# Altium project BoardDisplay.PrjPcb
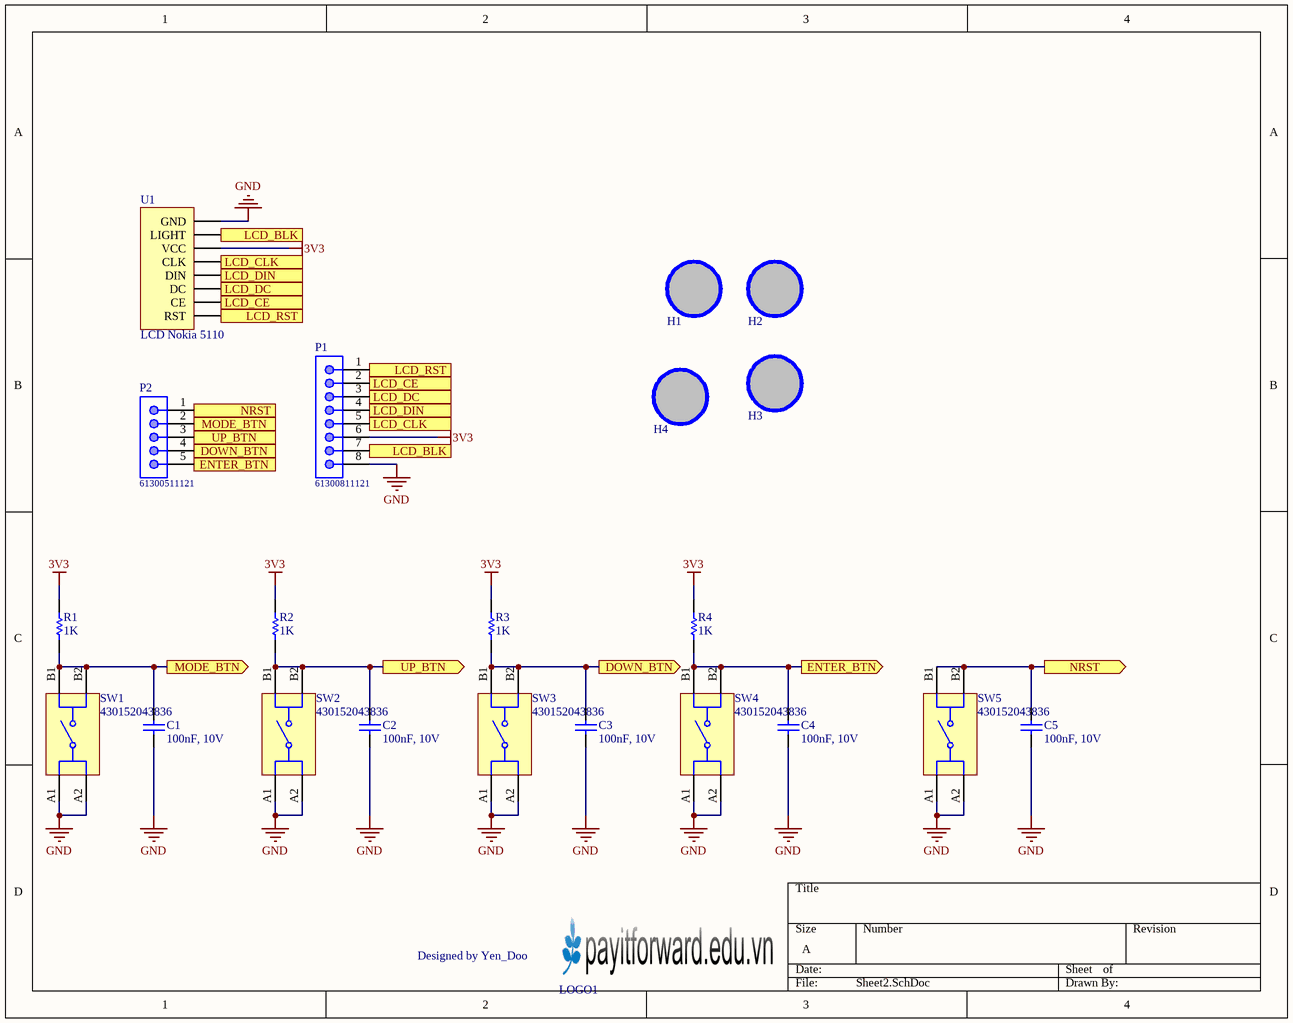
[diagram p0: Sheet2.SchDoc]
1 sheet, 23 parts. Net scope: flat (ports and power ports of the same name join across sheets).
Board file: PCB4.PcbDoc

## Sheet Sheet2.SchDoc
size A; SheetNumber: 1; SheetTotal: 1

### Parts
*1  LOGO_DOO  [Logo_Top_Overlay]  (value not drawn)
C1  100nF, 10V  [WCAP-CSGP_0603_H=0.8mm_Reflow]
C2  100nF, 10V  [WCAP-CSGP_0603_H=0.8mm_Reflow]
C3  100nF, 10V  [WCAP-CSGP_0603_H=0.8mm_Reflow]
C4  100nF, 10V  [WCAP-CSGP_0603_H=0.8mm_Reflow]
C5  100nF, 10V  [WCAP-CSGP_0603_H=0.8mm_Reflow]
H1  Hole  [LO KHOAN 3MM]  (value not drawn)
H2  Hole  [LO KHOAN 3MM]  (value not drawn)
H3  Hole  [LO KHOAN 3MM]  (value not drawn)
H4  Hole  [LO KHOAN 3MM]  (value not drawn)
LOGO1  LOGO PIF  [PIF LOGO BIG SSTOP]  (value not drawn)
P1  61300811121  [61300811121]
P2  61300511121  [61300511121]
R1  value 1K  [RES-SM-0603]  (hidden comment: RESISTOR SMD)
R2  value 1K  [RES-SM-0603]  (hidden comment: RESISTOR SMD)
R3  value 1K  [RES-SM-0603]  (hidden comment: RESISTOR SMD)
R4  value 1K  [RES-SM-0603]  (hidden comment: RESISTOR SMD)
SW1  430152043836  [WS-TASV_L6W6H4.3_4301x20438x6]
SW2  430152043836  [WS-TASV_L6W6H4.3_4301x20438x6]
SW3  430152043836  [WS-TASV_L6W6H4.3_4301x20438x6]
SW4  430152043836  [WS-TASV_L6W6H4.3_4301x20438x6]
SW5  430152043836  [WS-TASV_L6W6H4.3_4301x20438x6]
U1  LCD Nokia 5110  [LCD5110]

### Ports
DOWN_BTN (in), DOWN_BTN (out), ENTER_BTN (in), ENTER_BTN (out), LCD_BLK (in), LCD_BLK (out), LCD_CE (in), LCD_CE (out), LCD_CLK (in), LCD_CLK (out), LCD_DC (in), LCD_DC (out), LCD_DIN (in), LCD_DIN (out), LCD_RST (in), LCD_RST (out), MODE_BTN (in), MODE_BTN (out), NRST (in), NRST (out), UP_BTN (in), UP_BTN (out)

### Nets
3V3: P1.6 R1.2 R2.2 R3.2 R4.2 U1.6(VCC)
GND: C1.1 C2.1 C3.1 C4.1 C5.1 P1.8 SW1.A1 SW1.A2 SW2.A1 SW2.A2 SW3.A1 SW3.A2 SW4.A1 SW4.A2 SW5.A1 SW5.A2 U1.8(GND)
NetC1_2: C1.2 P2.2 R1.1 SW1.B1 SW1.B2 ; port MODE_BTN
NetC2_2: C2.2 P2.3 R2.1 SW2.B1 SW2.B2 ; port UP_BTN
NetC3_2: C3.2 P2.4 R3.1 SW3.B1 SW3.B2 ; port DOWN_BTN
NetC4_2: C4.2 P2.5 R4.1 SW4.B1 SW4.B2 ; port ENTER_BTN
NetC5_2: C5.2 P2.1 SW5.B1 SW5.B2 ; port NRST
NetP1_1: P1.1 U1.1(RST) ; port LCD_RST
NetP1_2: P1.2 U1.2(CE) ; port LCD_CE
NetP1_3: P1.3 U1.3(DC) ; port LCD_DC
NetP1_4: P1.4 U1.4(DIN) ; port LCD_DIN
NetP1_5: P1.5 U1.5(CLK) ; port LCD_CLK
NetP1_7: P1.7 U1.7(LIGHT) ; port LCD_BLK

Not connected (* = marked no-connect by the designer): H1 1; H2 1; H3 1; H4 1

### Notes on the sheet
- (in symbol LOGO_DOO) Designed by Yen_Doo

### Library data of the parts
C1-C5 = 885012206020: WCAP-CSGP Multilayer Ceramic Chip Capacitor, General Purpose, size 0603, X7R, 100nF, 10V; Manufacturer: Wurth Elektronik; Rated Voltage: 10VDC; Isolation Resistance: >=5GOhm; Capacitance Tolerance: +/-10%; Technical Reference: X7R0603104K010DFCT10000; ComponentLink1Description: Manufacturer; ComponentLink1URL: http://www.we-online.de; ComponentLink2Description: Datasheet; ComponentLink2URL: https://www.we-online.com/catalog/datasheet/885012206020.pdf; Operating Temperature: -55 to +125degC; Packaging: Tape and Reel; Manufacturer Part Number: 885012206020; Published Date: May 2020; Ceramic Type: X7R; Dissipation Factor: =<5%; Height: 0.8mm; Mounting Technology: SMT; Size: 0603; Capacitance: 100nF
H1-H4 = Hole: Hole 3mm
P1 = 61300811121: WR-PHD Pin Header, THT, pitch 2.54mm, Single Row, Vertical, 8p; Manufacturer: Wurth Elektronik; Pin Number: 8; Rated Current: 3A; Working Voltage: 250VAC; Withstanding Voltage: 500VAC; Contact Resistance: 20mOhm; ComponentLink1Description: Manufacturer; ComponentLink1URL: http://www.we-online.de; ComponentLink2Description: Datasheet; ComponentLink2URL: https://www.we-online.com/catalog/datasheet/61300811121.pdf; Manufacturer Part Number: 61300811121; Published Date: May 2020; Pitch: 2.54mm; Operating Temperature: -40 to +105degC; Mounting Technology: THT; Packaging: Bag; Gender: Pin Header; Row Number: Single; Orientation: Vertical
P2 = 61300511121: WR-PHD Pin Header, THT, pitch 2.54mm, Single Row, Vertical, 5p; Manufacturer: Wurth Elektronik; Pin Number: 5; Rated Current: 3A; Working Voltage: 250VAC; Withstanding Voltage: 500VAC; Contact Resistance: 20mOhm; ComponentLink1Description: Manufacturer; ComponentLink1URL: http://www.we-online.de; ComponentLink2Description: Datasheet; ComponentLink2URL: https://www.we-online.com/catalog/datasheet/61300511121.pdf; Manufacturer Part Number: 61300511121; Published Date: May 2020; Pitch: 2.54mm; Operating Temperature: -40 to +105degC; Mounting Technology: THT; Packaging: Bag; Gender: Pin Header; Row Number: Single; Orientation: Vertical
R1-R4 = RESISTOR SMD: Resistor
SW1-SW5 = 430152043836: WS-TASV SMT Tact Switch, 12VDC, 50mA, 360g, height 4.3mm; Manufacturer: Wurth Elektronik; Rated Voltage: 12V; Washable: No; Actuator Color: Salmon; Electrical Life: 200000Cycles; ComponentLink1Description: Manufacturer Link; ComponentLink1URL: http://www.we-online.de; ComponentLink2Description: Datasheet; ComponentLink2URL: https://www.we-online.com/catalog/datasheet/430152043836.pdf; Manufacturer Part Number: 430152043836; Contact Material: Stainless Steel; Mounting Technology: SMT; Contact Plating: Silver; Operation Force: 360g; Packaging: Tape and Reel; Terminal Material: Copper Alloy; Rated Current: 50mA; Terminal Plating: Silver; Height: 4.3mm; Length: 6mm; Operating Temperature max.: 85C; Operating Temperature min.: -40C; Width: 6mm
U1 = LCD_Nokia_5110